# EasyEDA schematic 1-Schematic_GPIO_WAVER.json
TITLE: Sheet_1; REV: 1.0; Date: 2022-12-25; Sheet: 1/1; Drawn By: maarnotto; Company: Your Company
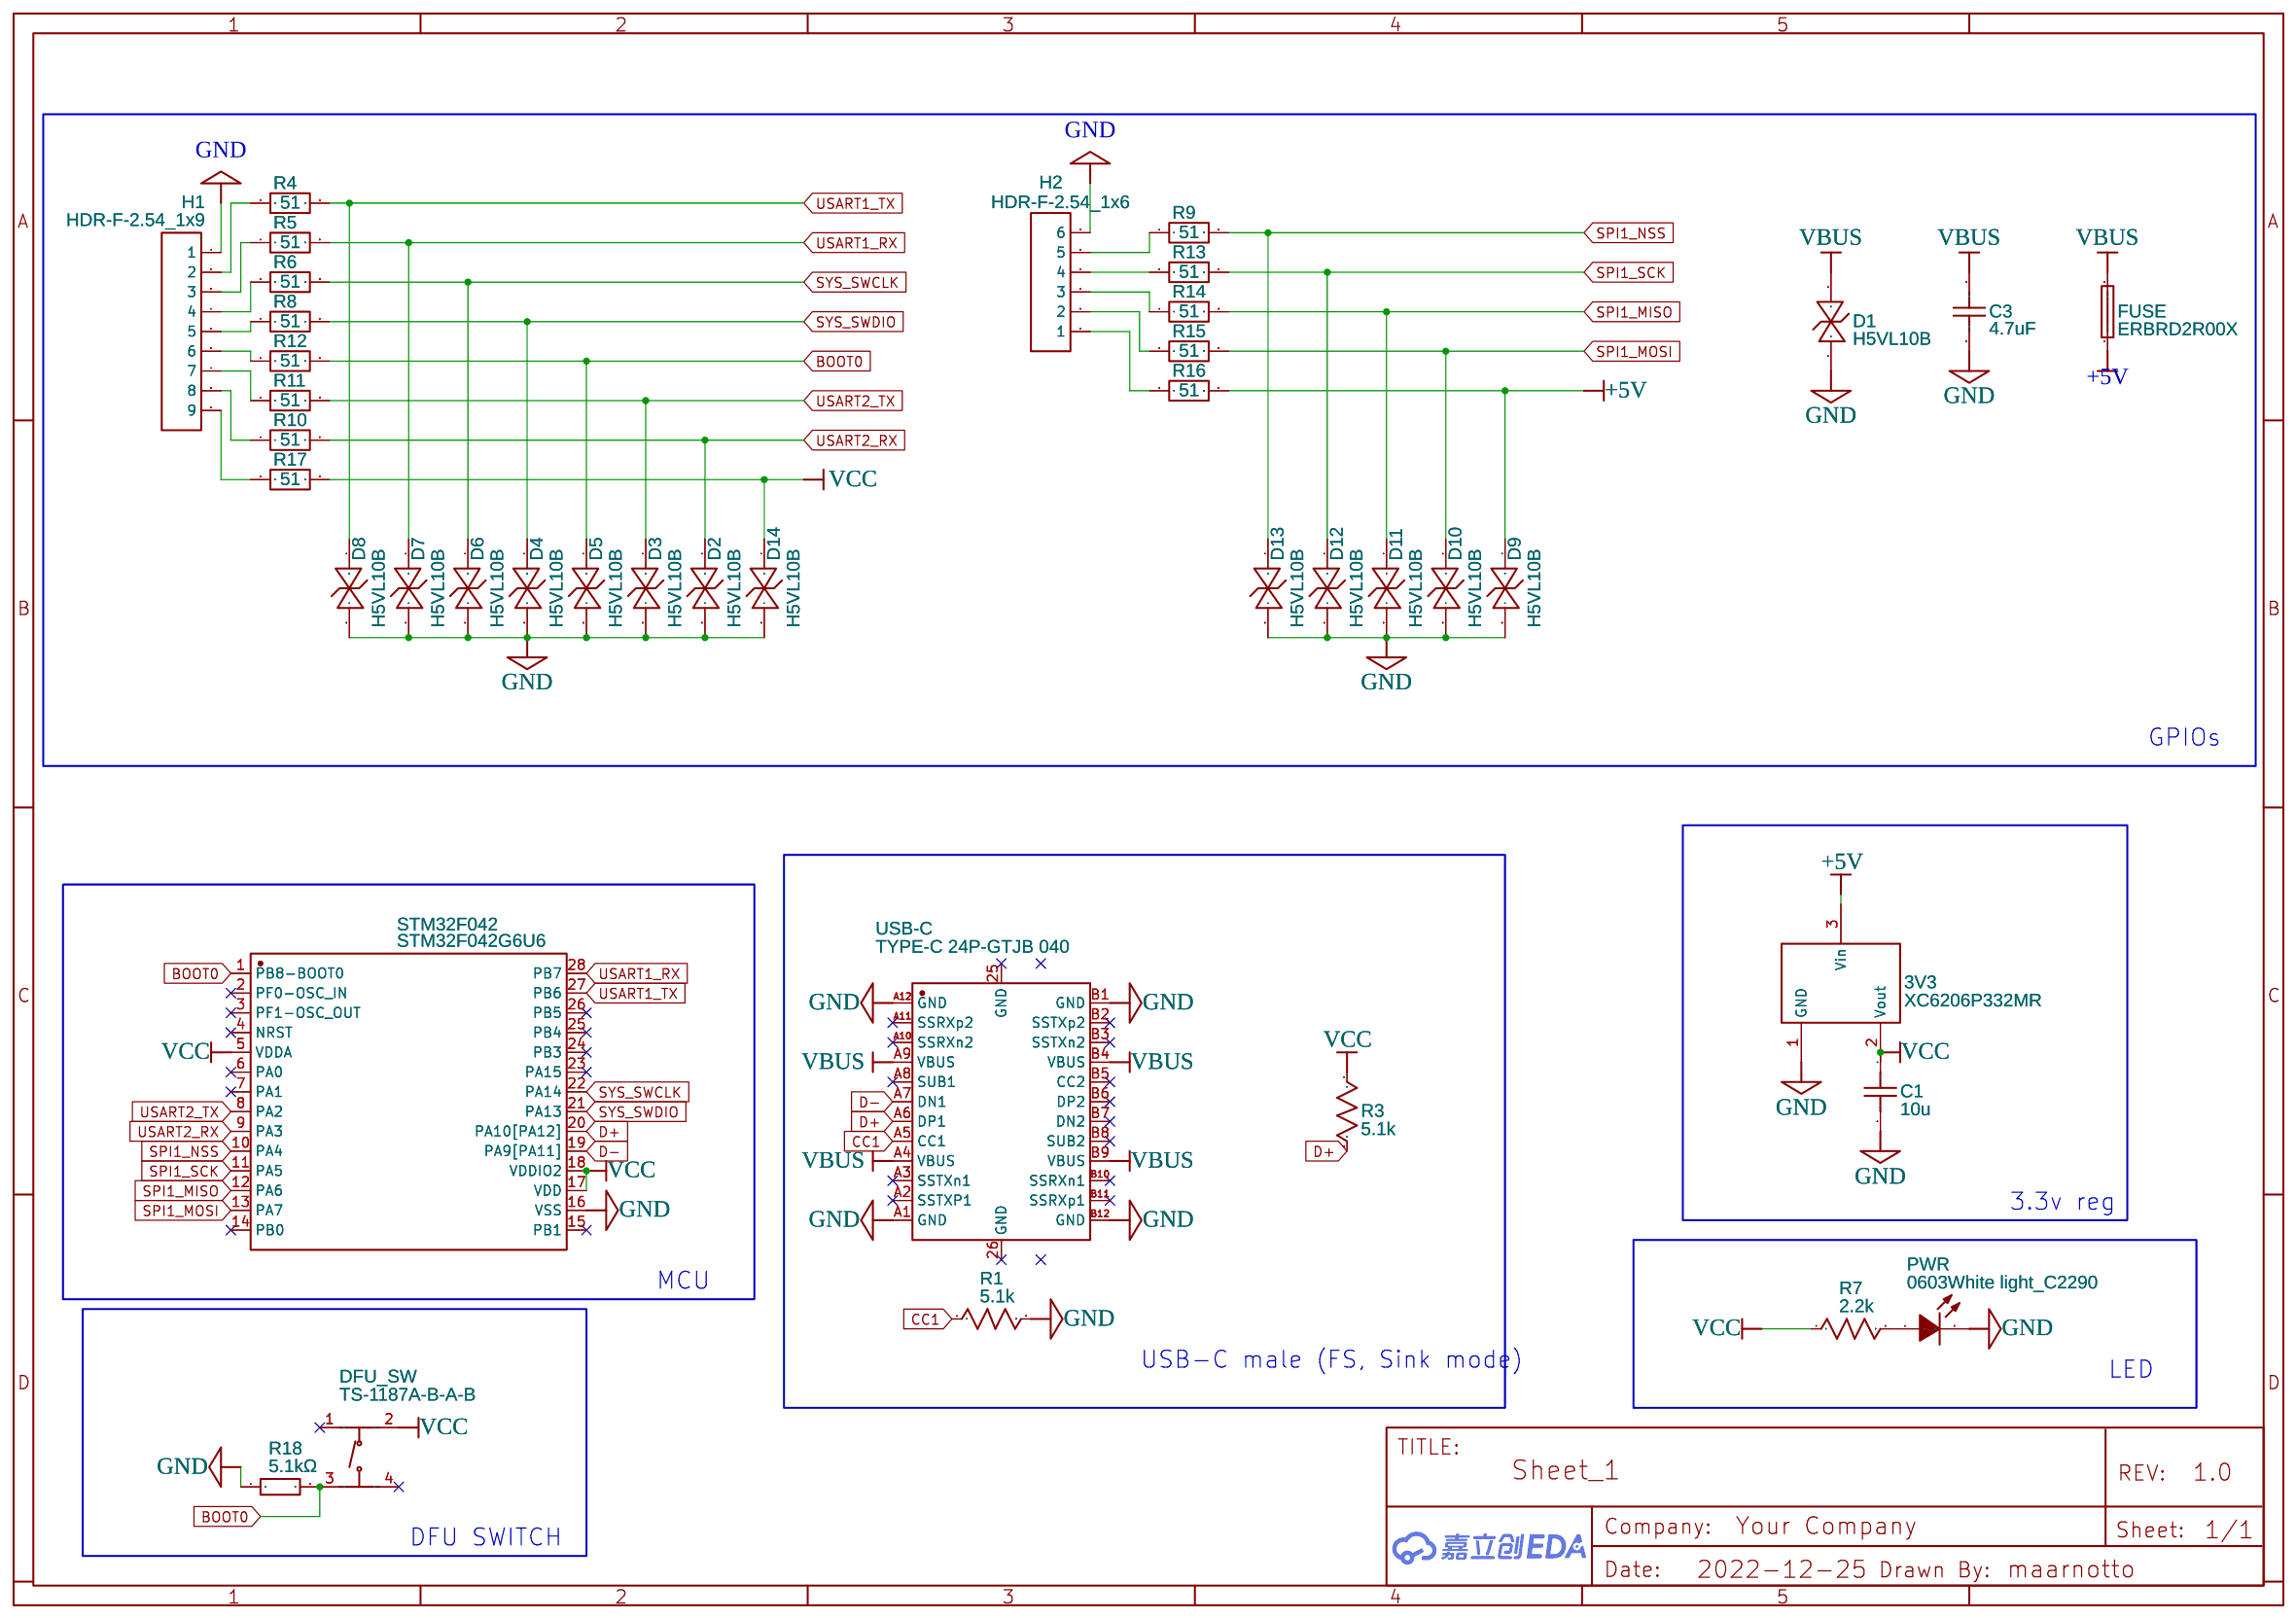
[diagram p0: schematic sheet]

## Parts
3V3  XC6206P332MR  [SOT-23-3_L2.9-W1.6-P1.90-LS2.8-BR]
C1  10u  [C0603]
C3  4.7uF  [C0603]
D1  H5VL10B  [SOD-882_L1.0-W0.6-BI]
D2  H5VL10B  [SOD-882_L1.0-W0.6-BI]
D3  H5VL10B  [SOD-882_L1.0-W0.6-BI]
D4  H5VL10B  [SOD-882_L1.0-W0.6-BI]
D5  H5VL10B  [SOD-882_L1.0-W0.6-BI]
D6  H5VL10B  [SOD-882_L1.0-W0.6-BI]
D7  H5VL10B  [SOD-882_L1.0-W0.6-BI]
D8  H5VL10B  [SOD-882_L1.0-W0.6-BI]
D9  H5VL10B  [SOD-882_L1.0-W0.6-BI]
D10  H5VL10B  [SOD-882_L1.0-W0.6-BI]
D11  H5VL10B  [SOD-882_L1.0-W0.6-BI]
D12  H5VL10B  [SOD-882_L1.0-W0.6-BI]
D13  H5VL10B  [SOD-882_L1.0-W0.6-BI]
D14  H5VL10B  [SOD-882_L1.0-W0.6-BI]
DFU_SW  TS-1187A-B-A-B  [SW-SMD_4P-L5.1-W5.1-P3.70-LS6.5-TL-2]
FUSE  ERBRD2R00X  [F0402]
H1  HDR-F-2.54_1x9  [HDR-F-2.54_1X9]
H2  HDR-F-2.54_1x6  [HDR-F-2.54_1X6]
PWR  0603White light_C2290  [LED0603-R-RD_WHITE]
R1  5.1k  [R0603]
R3  5.1k  [R0603]
R4  51  [R0603]
R5  51  [R0603]
R6  51  [R0603]
R7  2.2k  [R0603]
R8  51  [R0603]
R9  51  [R0603]
R10  51  [R0603]
R11  51  [R0603]
R12  51  [R0603]
R13  51  [R0603]
R14  51  [R0603]
R15  51  [R0603]
R16  51  [R0603]
R17  51  [R0603]
R18  5.1kΩ  [R0402]
STM32F042  STM32F042G6U6  [UFQFPN-28_L4.0-W4.0-P0.50-BL]
USB-C  TYPE-C 24P-GTJB 040  [USB-C-SMD_TYPE-C-24P-GTJB-040]

## Library data of the parts
3V3 = XC6206P332MR: Supplier: LCSC; Manufacturer: TOREX(特瑞仕); Supplier Part: C5446; JLCPCB Part Class: Basic Part
C1 C3 = C_0603_US: Contributor: LCEDA_Lib
D1-D14 = H5VL10B: Supplier: LCSC; Supplier Part: C7420372; Manufacturer: 宏迦橙; Contributor: lcsc; JLCPCB Part Class: Extended Part
DFU_SW = TS-1187A-B-A-B: Supplier: LCSC; Supplier Part: C318884; Manufacturer: XKB Connectivity(中国星坤); Contributor: LCSC; JLCPCB Part Class: Basic Part
FUSE = ERBRD2R00X: Contributor: LCSC; Supplier: LCSC; Supplier Part: C424348; Manufacturer: PANASONIC(松下); JLCPCB Part Class: Extended Part
H1 = HDR-F-2.54_1x9: Supplier Part: C124417; Supplier: LCSC; Contributor: LCEDA_Lib
H2 = HDR-F-2.54_1x6: Supplier Part: C40877; Supplier: LCSC; Contributor: LCEDA_Lib
PWR = 0603White light_C2290: Supplier: LCSC; Manufacturer: null; Manufacturer Part: KT-0603白灯; Supplier Part: C2290; JLCPCB Part Class: Basic Part
R1 R3 R7 = R_0603_US: Contributor: LCEDA_Lib
R4-R6 R8-R17 = R_0603_EU: Contributor: LCEDA_Lib
R18 = 0402WGF5101TCE: Supplier: LCSC; Manufacturer: UNI-ROYAL(厚声); Supplier Part: C25905; JLCPCB Part Class: Basic Part
STM32F042 = STM32F042G6U6: Contributor: LCSC; Supplier: LCSC; Supplier Part: C961597; Manufacturer: ST(意法半导体); JLCPCB Part Class: Extended Part
USB-C = TYPE-C 24P-GTJB 040: Supplier: LCSC; Supplier Part: C3151751; Manufacturer: SHOU HAN(首韩); Contributor: lcsc; JLCPCB Part Class: Extended Part

## Nets
+5V: 3V3.3(Vin) D9.1(C) FUSE.1 R16.2
GND: 3V3.1(GND) C1.2 C3.1 D1.2(A) D2.2(A) D3.2(A) D4.2(A) D5.2(A) D6.2(A) D7.2(A) D8.2(A) D9.2(A) D10.2(A) D11.2(A) D12.2(A) D13.2(A) D14.2(A) H1.1 H2.6 PWR.2(K) R1.2 R18.1 STM32F042.16(VSS) USB-C.A1(GND) USB-C.A12(GND) USB-C.B1(GND) USB-C.B12(GND)
VBUS: C3.2 D1.1(C) FUSE.2 USB-C.A4(VBUS) USB-C.A9(VBUS) USB-C.B4(VBUS) USB-C.B9(VBUS)
VCC: 3V3.2(Vout) C1.1 D14.1(C) DFU_SW.2(B) R3.1 R7.1 R17.2 STM32F042.5(VDDA) STM32F042.17(VDD) STM32F042.18(VDDIO2)
BOOT0: D5.1(C) DFU_SW.3(C) R12.2 R18.2 STM32F042.1(PB8-BOOT0)
CC1: R1.1 USB-C.A5(CC1)
D+: R3.2 STM32F042.20(PA10[PA12]) USB-C.A6(DP1)
D-: STM32F042.19(PA9[PA11]) USB-C.A7(DN1)
SPI1_MISO: D11.1(C) R14.2 STM32F042.12(PA6)
SPI1_MOSI: D10.1(C) R15.2 STM32F042.13(PA7)
SPI1_NSS: D13.1(C) R9.2 STM32F042.10(PA4)
SPI1_SCK: D12.1(C) R13.2 STM32F042.11(PA5)
SYS_SWCLK: D6.1(C) R6.2 STM32F042.22(PA14)
SYS_SWDIO: D4.1(C) R8.2 STM32F042.21(PA13)
USART1_RX: D7.1(C) R5.2 STM32F042.28(PB7)
USART1_TX: D8.1(C) R4.2 STM32F042.27(PB6)
USART2_RX: D2.1(C) R10.2 STM32F042.9(PA3)
USART2_TX: D3.1(C) R11.2 STM32F042.8(PA2)
Net-(H1-2): H1.2 R4.1
Net-(H1-3): H1.3 R5.1
Net-(H1-4): H1.4 R6.1
Net-(H1-5): H1.5 R8.1
Net-(H1-6): H1.6 R12.1
Net-(H1-7): H1.7 R11.1
Net-(H1-8): H1.8 R10.1
Net-(H1-9): H1.9 R17.1
Net-(H2-1): H2.1 R16.1
Net-(H2-2): H2.2 R15.1
Net-(H2-3): H2.3 R14.1
Net-(H2-4): H2.4 R13.1
Net-(H2-5): H2.5 R9.1
Net-(PWR-1): PWR.1(A) R7.2

Not connected (* = marked no-connect by the designer): DFU_SW 1(A)* 4(D)*; STM32F042 2(PF0-OSC_IN)* 3(PF1-OSC_OUT)* 4(NRST)* 6(PA0)* 7(PA1)* 14(PB0)* 15(PB1)* 23(PA15)* 24(PB3)* 25(PB4)* 26(PB5)*; USB-C 25(GND)* 26(GND)* A2(SSTXP1)* A3(SSTXn1)* A8(SUB1)* A10(SSRXn2)* A11(SSRXp2)* B2(SSTXp2)* B3(SSTXn2)* B5(CC2)* B6(DP2)* B7(DN2)* B8(SUB2)* B10(SSRXn1)* B11(SSRXp1)*

## Notes on the sheet
- GPIOs
- 3.3v reg
- MCU
- USB-C male (FS, Sink mode)
- LED
- DFU SWITCH
